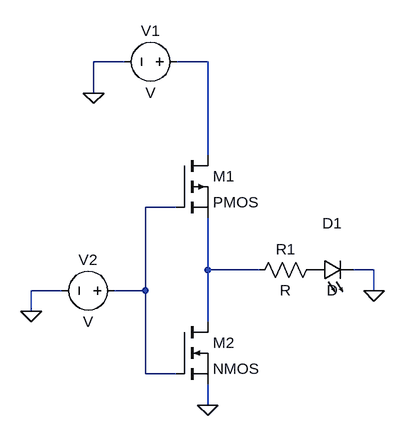
[diagram p0: schematic CMOS_NOT_Gate.asc]
CMOS_NOT_Gate.asc, the LTspice schematic file:
Version 4
SHEET 1 880 680
WIRE 16 -80 -32 -80
WIRE 144 -80 96 -80
WIRE -32 -32 -32 -80
WIRE 144 64 144 -80
WIRE 96 144 48 144
WIRE 144 240 144 160
WIRE 224 240 144 240
WIRE 400 240 368 240
WIRE -80 272 -128 272
WIRE 48 272 48 144
WIRE 48 272 0 272
WIRE 400 272 400 240
WIRE -128 304 -128 272
WIRE 144 320 144 240
WIRE 48 400 48 272
WIRE 96 400 48 400
WIRE 144 448 144 416
FLAG -32 -32 0
FLAG -128 304 0
FLAG 400 272 0
FLAG 144 448 0
SYMBOL pmos 96 64 R0
SYMATTR InstName M1
SYMBOL nmos 96 320 R0
SYMATTR InstName M2
SYMBOL voltage 112 -80 R90
WINDOW 0 -32 56 VBottom 2
WINDOW 3 32 56 VTop 2
SYMATTR InstName V1
SYMBOL voltage 16 272 R90
WINDOW 0 -32 56 VBottom 2
WINDOW 3 32 56 VTop 2
SYMATTR InstName V2
SYMBOL res 320 224 R90
WINDOW 0 0 56 VBottom 2
WINDOW 3 32 56 VTop 2
SYMATTR InstName R1
SYMBOL LED 304 256 R270
WINDOW 0 72 32 VTop 2
WINDOW 3 0 32 VBottom 2
SYMATTR InstName D1

The netlist it stands for:
* CMOS_NOT_Gate.asc
M1 N001 N002 N003 N003 PMOS
M2 N003 N002 0 0 NMOS
V1 N001 0 V
V2 N002 0 V
R1 P001 N003 R
D1 P001 0 D
.model D D
.lib standard.dio
.model NMOS NMOS
.model PMOS PMOS
.lib standard.mos
.backanno
.end